# EAGLE schematic sevenSeg4_atmega_4C_noGND (EAGLE 7.5.0)
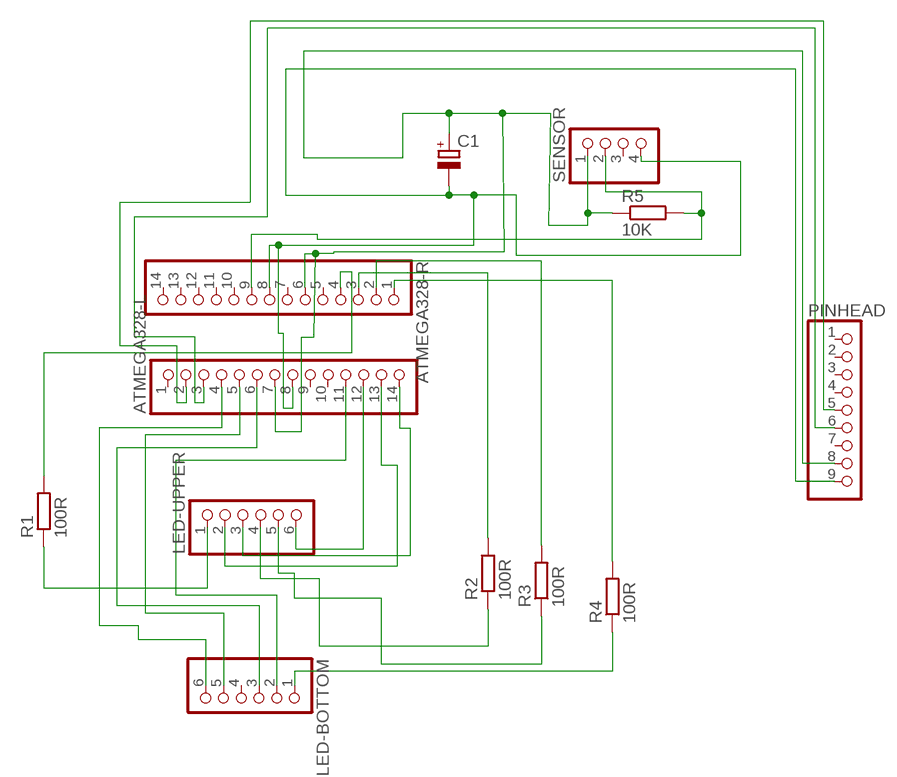
[diagram p0: schematic, sheet 1]

## Parts
ATMEGA328-L  PINHD-1X14  [1X14]
ATMEGA328-R  PINHD-1X14  [1X14]
C1  CPOL-EUE2.5-7  [E2,5-7]
LED-BOTTOM  PINHD-1X6  [1X06]
LED-UPPER  PINHD-1X6  [1X06]
PINHEAD  PINHD-1X9  [1X09]
R1  100R  R-EU_R0603  [R0603]
R2  100R  R-EU_R0603  [R0603]
R3  100R  R-EU_R0603  [R0603]
R4  100R  R-EU_R0603  [R0603]
R5  10K  R-EU_R0603  [R0603]
SENSOR  PINHD-1X4  [1X04]

## Nets
N$1: ATMEGA328-L.7 ATMEGA328-R.6 C1.+ PINHEAD.8 R5.1 SENSOR.1
N$2: ATMEGA328-R.9 R5.2 SENSOR.2
N$4: ATMEGA328-L.3 PINHEAD.6
N$7: ATMEGA328-L.4 LED-BOTTOM.6
N$8: ATMEGA328-L.5 LED-BOTTOM.5
N$9: ATMEGA328-L.6 LED-BOTTOM.3
N$10: ATMEGA328-L.11 LED-BOTTOM.2
N$11: LED-UPPER.1 R1.1
N$12: ATMEGA328-L.12 LED-UPPER.6
N$13: ATMEGA328-R.3 R2.2
N$14: LED-UPPER.4 R2.1
N$15: ATMEGA328-L.13 LED-UPPER.2
N$16: ATMEGA328-L.14 LED-UPPER.3
N$17: ATMEGA328-R.4 R1.2
N$18: ATMEGA328-R.2 R3.2
N$19: LED-UPPER.5 R3.1
N$20: ATMEGA328-R.1 R4.2
N$21: LED-BOTTOM.1 R4.1
N$22: ATMEGA328-L.8 ATMEGA328-R.8 C1.- PINHEAD.9 SENSOR.4
N$24: ATMEGA328-L.2 PINHEAD.5
Unconnected: ATMEGA328-L.1 ATMEGA328-L.9 ATMEGA328-L.10 ATMEGA328-R.5 ATMEGA328-R.7 ATMEGA328-R.10 ATMEGA328-R.11 ATMEGA328-R.12 ATMEGA328-R.13 ATMEGA328-R.14 LED-BOTTOM.4 PINHEAD.1 PINHEAD.2 PINHEAD.3 PINHEAD.4 PINHEAD.7 SENSOR.3

## Library data of the parts
ATMEGA328-L ATMEGA328-R = pinhead:PINHD-1X14: PIN HEADER
C1 = rcl:CPOL-EU: POLARIZED CAPACITOR, European symbol
LED-BOTTOM LED-UPPER = pinhead:PINHD-1X6: PIN HEADER
PINHEAD = pinhead:PINHD-1X9: PIN HEADER
R1-R5 = resistor:R-EU_: RESISTOR, European symbol
SENSOR = pinhead:PINHD-1X4: PIN HEADER